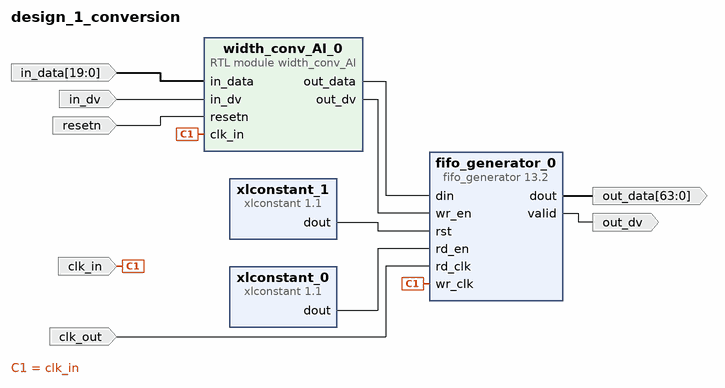
[diagram p0: block diagram of the top level]
# Vivado block design design_1_conversion, xc7a35tcsg324-1, Vivado 2019.1
create_bd_design design_1_conversion

create_bd_port -dir I -from 19 -to 0 -type data in_data
create_bd_port -dir I -type data in_dv
create_bd_port -dir I -type rst resetn
create_bd_port -dir O -from 63 -to 0 -type data out_data
create_bd_port -dir O -type data out_dv
create_bd_port -dir I clk_in
create_bd_port -dir I clk_out

create_bd_cell -type ip -vlnv xilinx.com:ip:fifo_generator:13.2 fifo_generator_0
set_property -dict [list \
  CONFIG.Enable_Safety_Circuit true \
  CONFIG.Fifo_Implementation Independent_Clocks_Block_RAM \
  CONFIG.Full_Flags_Reset_Value 1 \
  CONFIG.Input_Data_Width 64 \
  CONFIG.Output_Data_Width 64 \
  CONFIG.Valid_Flag true \
] [get_bd_cells fifo_generator_0]
create_bd_cell -type module -reference width_conv_AI width_conv_AI_0
create_bd_cell -type ip -vlnv xilinx.com:ip:xlconstant:1.1 xlconstant_1
set_property -dict {CONFIG.CONST_VAL 0} [get_bd_cells xlconstant_1]
create_bd_cell -type ip -vlnv xilinx.com:ip:xlconstant:1.1 xlconstant_0

# ---- connections ----

connect_bd_net [get_bd_ports in_data] [get_bd_pins width_conv_AI_0/in_data]
connect_bd_net [get_bd_ports in_dv] [get_bd_pins width_conv_AI_0/in_dv]
connect_bd_net [get_bd_ports clk_in] [get_bd_pins width_conv_AI_0/clk_in] [get_bd_pins fifo_generator_0/wr_clk]
connect_bd_net [get_bd_pins width_conv_AI_0/out_data] [get_bd_pins fifo_generator_0/din]
connect_bd_net [get_bd_pins fifo_generator_0/dout] [get_bd_ports out_data]
connect_bd_net [get_bd_pins fifo_generator_0/valid] [get_bd_ports out_dv]
connect_bd_net [get_bd_ports clk_out] [get_bd_pins fifo_generator_0/rd_clk]
connect_bd_net [get_bd_ports resetn] [get_bd_pins width_conv_AI_0/resetn]
connect_bd_net [get_bd_pins xlconstant_1/dout] [get_bd_pins fifo_generator_0/rst]
connect_bd_net [get_bd_pins width_conv_AI_0/out_dv] [get_bd_pins fifo_generator_0/wr_en]
connect_bd_net [get_bd_pins xlconstant_0/dout] [get_bd_pins fifo_generator_0/rd_en]

validate_bd_design
save_bd_design
